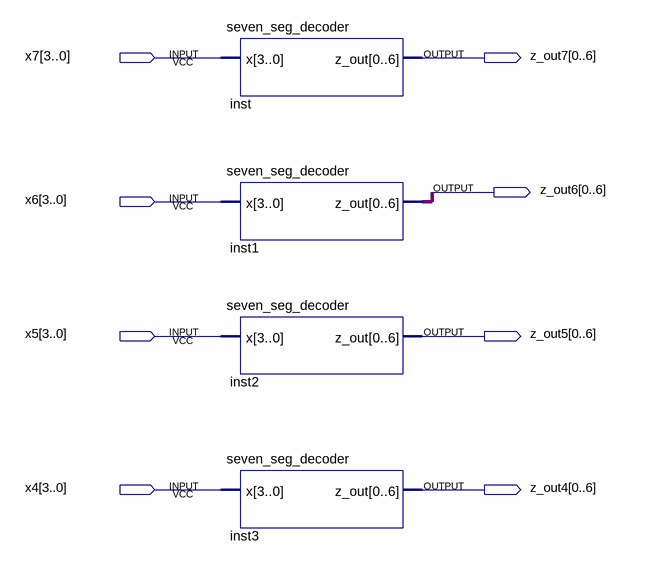
[diagram p0: schematic sheet]
// Quartus schematic lab5step1.bdf as structural Verilog: 4 symbols, 8 pins
module lab5step1 (
  input  [3:0] x7,
  input  [3:0] x6,
  input  [3:0] x5,
  input  [3:0] x4,
  output [0:6] z_out7,
  output [0:6] z_out6,
  output [0:6] z_out5,
  output [0:6] z_out4
);

  seven_seg_decoder inst (.x(x7), .z_out(z_out7));
  seven_seg_decoder inst1 (.x(x6), .z_out(z_out6));
  seven_seg_decoder inst2 (.x(x5), .z_out(z_out5));
  seven_seg_decoder inst3 (.x(x4), .z_out(z_out4));
endmodule
